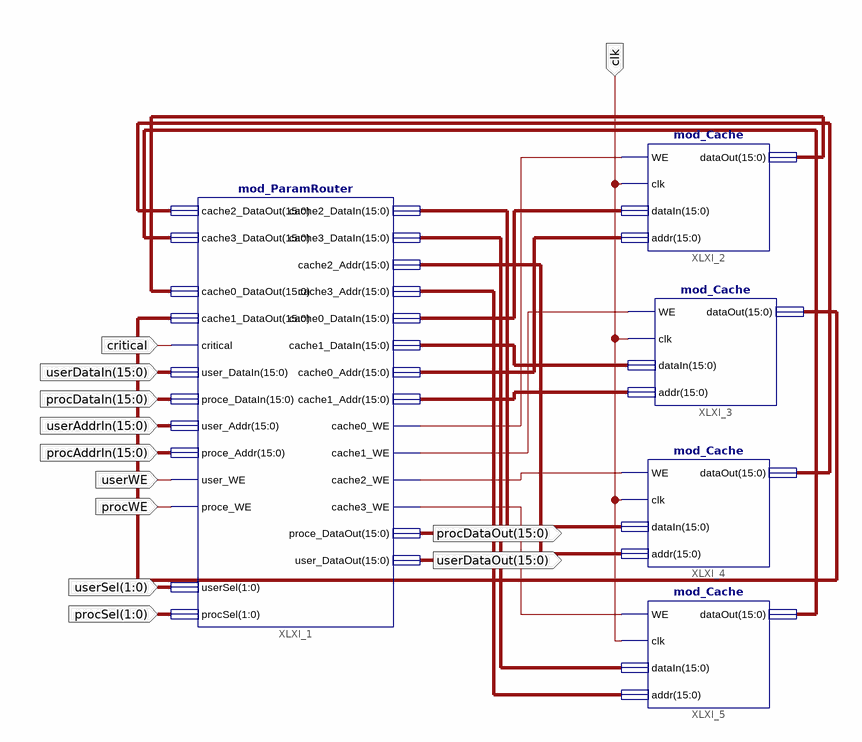
[diagram p0: schematic sheet 1]
// Xilinx ISE schematic mod_Params.sch (spartan3e) as structural Verilog: 5 symbols, 12 ports
module mod_Params (
  input  clk,
  input  critical,
  input  [15:0] userDataIn,
  input  [15:0] procDataIn,
  input  [15:0] userAddrIn,
  input  [15:0] procAddrIn,
  input  userWE,
  input  procWE,
  input  [1:0] userSel,
  input  [1:0] procSel,
  output [15:0] procDataOut,
  output [15:0] userDataOut
);

  wire XLXN_1, XLXN_2, XLXN_3, XLXN_4;
  wire [15:0] XLXN_5, XLXN_6, XLXN_7, XLXN_8, XLXN_9, XLXN_10, XLXN_12, XLXN_13, XLXN_14, XLXN_15, XLXN_16,
       XLXN_17;

  mod_ParamRouter XLXI_1 (
    .cache2_DataOut(XLXN_12), .cache3_DataOut(XLXN_13), .cache0_DataOut(XLXN_9), .cache1_DataOut(XLXN_10),
    .critical(critical), .user_DataIn(userDataIn), .proce_DataIn(procDataIn), .user_Addr(userAddrIn),
    .proce_Addr(procAddrIn), .user_WE(userWE), .proce_WE(procWE), .cache2_DataIn(XLXN_7),
    .cache3_DataIn(XLXN_8), .cache2_Addr(XLXN_16), .cache3_Addr(XLXN_17), .cache0_DataIn(XLXN_5),
    .cache1_DataIn(XLXN_6), .cache0_Addr(XLXN_14), .cache1_Addr(XLXN_15), .cache0_WE(XLXN_1),
    .cache1_WE(XLXN_2), .cache2_WE(XLXN_3), .cache3_WE(XLXN_4), .proce_DataOut(procDataOut),
    .user_DataOut(userDataOut), .userSel(userSel), .procSel(procSel));
  mod_Cache XLXI_2 (.WE(XLXN_1), .clk(clk), .dataIn(XLXN_5), .addr(XLXN_14), .dataOut(XLXN_9));
  mod_Cache XLXI_3 (.WE(XLXN_2), .clk(clk), .dataIn(XLXN_6), .addr(XLXN_15), .dataOut(XLXN_10));
  mod_Cache XLXI_4 (.WE(XLXN_3), .clk(clk), .dataIn(XLXN_7), .addr(XLXN_16), .dataOut(XLXN_12));
  mod_Cache XLXI_5 (.WE(XLXN_4), .clk(clk), .dataIn(XLXN_8), .addr(XLXN_17), .dataOut(XLXN_13));
endmodule
